# Altium schematic sheet 3.3V.SchDoc: 3.3V
size A; DrawnBy: Elijah; SheetNumber: 1; SheetTotal: 7
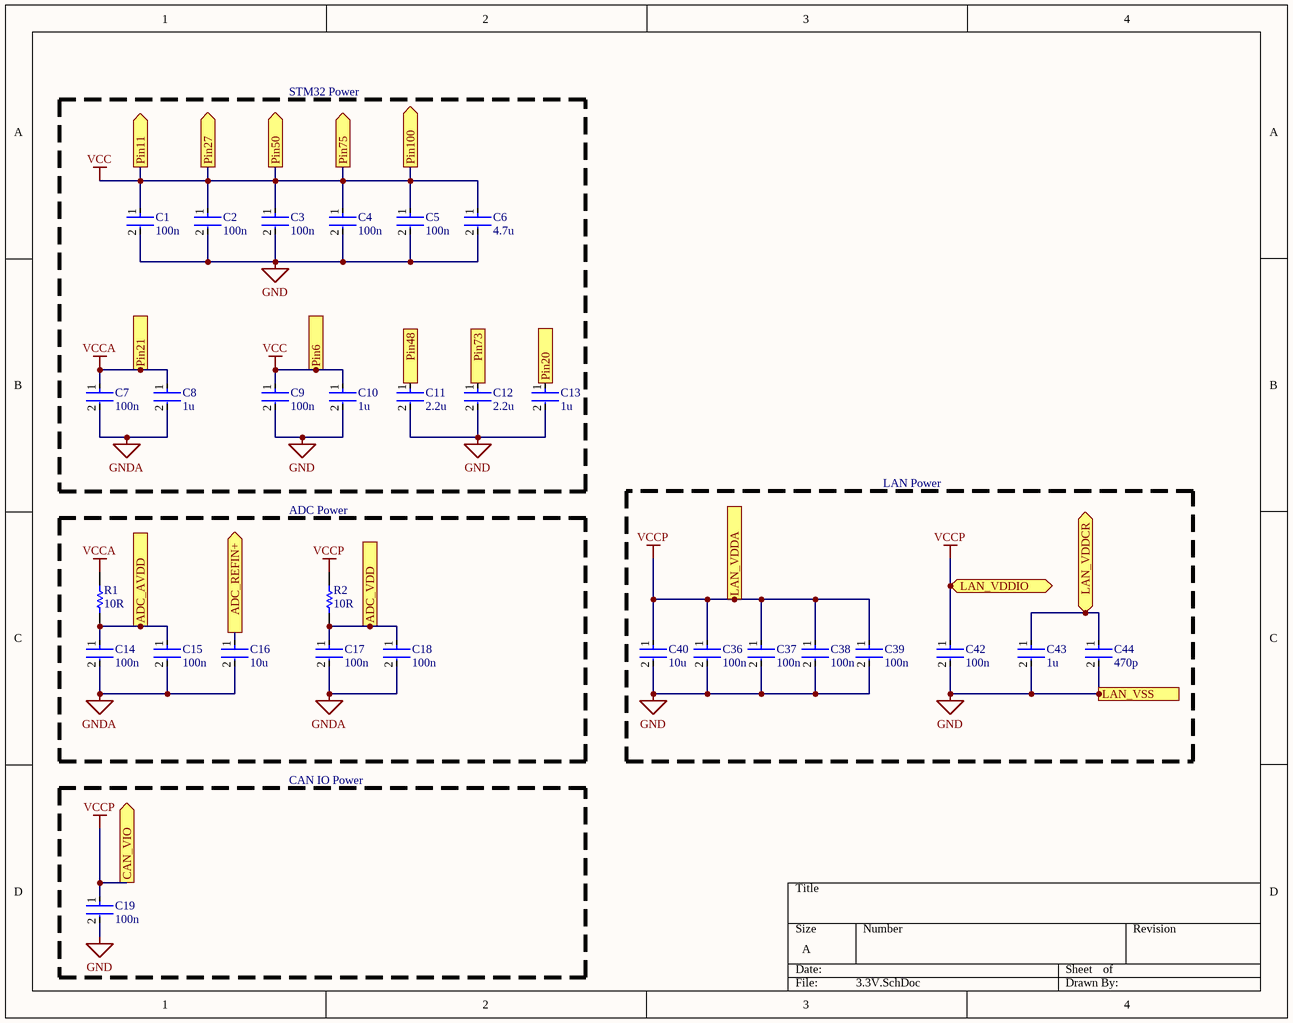
[diagram p0: 3.3V.SchDoc]

## Parts
C1  100n  [FP-GRM033-0_03-MFG]
C2  100n  [FP-GRM033-0_03-MFG]
C3  100n  [FP-GRM033-0_03-MFG]
C4  100n  [FP-GRM033-0_03-MFG]
C5  100n  [FP-GRM033-0_03-MFG]
C6  4.7u  [FP-C1005-050-0_15-MFG]
C7  100n  [FP-GRM033-0_03-MFG]
C8  1u  [FP-C2012-125-0_2-IPC_A]
C9  100n  [FP-GRM033-0_03-MFG]
C10  1u  [FP-C2012-125-0_2-IPC_A]
C11  2.2u  [FP-GRM188-0_1-e0_2_0_5-MFG]
C12  2.2u  [FP-GRM188-0_1-e0_2_0_5-MFG]
C13  1u  [FP-C2012-125-0_2-IPC_A]
C14  100n  [FP-GRM033-0_03-MFG]
C15  100n  [FP-GRM033-0_03-MFG]
C16  10u  [FP-C0805C-DG-MFG]
C17  100n  [FP-GRM033-0_03-MFG]
C18  100n  [FP-GRM033-0_03-MFG]
C19  100n  [FP-GRM033-0_03-MFG]
C36  100n  [FP-GRM033-0_03-MFG]
C37  100n  [FP-GRM033-0_03-MFG]
C38  100n  [FP-GRM033-0_03-MFG]
C39  100n  [FP-GRM033-0_03-MFG]
C40  10u  [FP-C0805C-DG-MFG]
C42  100n  [FP-GRM033-0_03-MFG]
C43  1u  [FP-C1005-050-0_15-MFG]
C44  470p  [FP-C1005-050-0_15-MFG]
R1  10R  [RESC2013X60X35ML10T20]
R2  10R  [RESC2013X60X35ML10T20]

## Blocks framed on the sheet
STM32 Power: C1-C13
LAN Power: C36-C40 C42-C44
ADC Power: C14-C18 R1 R2
CAN IO Power: C19

## Ports
ADC_AVDD (out, see ADC[1A]), ADC_REFIN+ (out, see ADC[2B]), ADC_VDD (out, see ADC[2A]), CAN_VIO (out, see ADC[3B]), LAN_VDDA (out, see ETH[2A]), LAN_VDDCR (bidir, see ETH[2B]), LAN_VDDIO (bidir, see ETH[2B]), LAN_VSS (see ETH[3C]), Pin6 (out, see MCUPinout[1A]), Pin11 (out, see MCUPinout[1B]), Pin20 (out, see MCUPinout[3B]), Pin21 (out, see MCUPinout[1B]), Pin27 (out, see MCUPinout[1B]), Pin48 (out, see MCUPinout[3C]), Pin50 (out, see MCUPinout[3A]), Pin73 (out, see MCUPinout[4B]), Pin75 (out, see MCUPinout[3B]), Pin100 (out, see MCUPinout[4A], MCUPinout[5B], MCUPinout[6B])

## Nets
GND: C1.2 C2.2 C3.2 C4.2 C5.2 C6.2 C9.2 C10.2 C11.2 C12.2 C13.2 C19.2 C36.2 C37.2 C38.2 C39.2 C40.2 C42.2 C43.2 C44.2 ; port LAN_VSS
GNDA: C7.2 C8.2 C14.2 C15.2 C16.2 C17.2 C18.2
VCC: C1.1 C2.1 C3.1 C4.1 C5.1 C6.1 C9.1 C10.1 ; port Pin11, port Pin27, port Pin50, port Pin75, port Pin100, port Pin6
VCCA: C7.1 C8.1 R1.1 ; port Pin21
VCCP: C19.1 C36.1 C37.1 C38.1 C39.1 C40.1 C42.1 R2.1 ; port CAN_VIO, port LAN_VDDA, port LAN_VDDIO
ADC_AVDD: C14.1 C15.1 R1.2 ; port ADC_AVDD
ADC_REFIN+: C16.1 ; port ADC_REFIN+
ADC_VDD: C17.1 C18.1 R2.2 ; port ADC_VDD
LAN_VDDCR: C43.1 C44.1 ; port LAN_VDDCR
Pin20: C13.1 ; port Pin20
Pin48: C11.1 ; port Pin48
Pin73: C12.1 ; port Pin73

## Library data of the parts
C1-C5 C7 C9 C14 C15 C17-C19 C36-C39 C42 = CMP-06035-000062-2: Chip Multilayer Ceramic Capacitors for General Purpose, 0201, 0.10uF, X5R, 15%, 10%, 6.3V; Capacitance: 100nF; Min Operating Temperature: -55°C; Lead Free: Lead Free; Radiation Hardening: No; Dielectric: X5R; Voltage Rating (DC): 6.3V; REACH SVHC: No SVHC; Case/Package: 0201; Voltage Rating: 6.3V; Length: 0.6mm; Max Operating Temperature: 85°C; Width: 0.012inch; Depth: 0.3mm; Material: Ceramic; Case Code (Metric): 0603; Thickness: 0.013inch; Packaging: Tape and Reel; Height: 0.3mm; Weight: 6E-06oz; Package Quantity: 1; Mount: Surface Mount; Voltage: 6.3V; Case Code (Imperial): 0201; Tolerance: 10%; Termination: SMD/SMT
C6 C43 C44 = CMP-2000-05997-2: CAP CER 4.7UF 10V X5R 0402; Dielectric Material: Ceramic; Tolerance: 10%; Series: C; Package Quantity: 10000; Max Operating Temperature: 85°C; Case Code (Imperial): 0402; Lead Free: Lead Free; Voltage Rating (DC): 10V; Packaging: Cut Tape; Voltage Rating: 10V; Min Operating Temperature: -55°C; Dielectric: X5R; Thickness: 0.022inch; Width: 0.02inch; Case/Package: 0402; Case Code (Metric): 1005; Capacitance: 4.7uF; Length: 0.039inch; RoHS Compliant: Yes; REACH SVHC: No SVHC; Mount: Surface Mount
C8 C10 C13 = CMP-08246-005389-1: Multilayer Ceramic Capacitors 1μF ±10% 25V X5R SMD 0805; Capacitance: 1uF; Min Operating Temperature: -55°C; Construction: Flat; Package Quantity: 2000; Height: 1.25mm; Resistor Type: Ceramic; Case/Package: 0805; Depth: 1.25mm; Case Code (Metric): 2012; Weight: 0.000194oz; REACH SVHC: No SVHC; Dielectric: X5R; Max Operating Temperature: 85°C; Number of Pins: 2; Thickness: 0.057inch; RoHS Compliant: Yes; Radiation Hardening: No; Lead Free: Lead Free; Case Code (Imperial): 0805; Length: 2mm; Voltage Rating: 25V; Mount: Surface Mount; Voltage Rating (DC): 25V; Packaging: Tape and Reel; Dielectric Material: Ceramic; Termination: SMD/SMT; Voltage: 25V; Tolerance: 10%; Series: C; Width: 0.049inch
C11 C12 = CMP-2006-02836-2: Chip Multilayer Ceramic Capacitors for General Purpose, 0603, 2.2uF, X7R, 15%, 10%, 10V; Case Code (Metric): 1608; Height: 0.8mm; Packaging: Cut Tape; Voltage: 10V; Lead Free: Lead Free; Min Operating Temperature: -55°C; Voltage Rating (DC): 10V; Max Operating Temperature: 125°C; Voltage Rating: 10V; Dielectric: X7R; Depth: 0.8mm; Case Code (Imperial): 0603; Termination: SMD/SMT; Case/Package: 0603; Number of Pins: 2; REACH SVHC: No SVHC; Mount: Surface Mount; Width: 0.031inch; Material: Ceramic; Capacitance: 2.2uF; Package Quantity: 1; Weight: 7.1E-05oz; Length: 1.6mm; Thickness: 0.035inch; Tolerance: 10%
C16 C40 = CMP-2007-03243-2: CAP CER 10UF 10V X5R 0805; Manufacturer Part Number: C0805C106K8PACTU; Manufacturer: Kemet; 3DS Part Number: 220-00001; Tolerance: 10%; Temperature Coefficient: 15%; Material: Ceramic; Device Class L2: Capacitors; Device Class L1: Passive Components; ComponentLink2URL: https://content.kemet.com/datasheets/KEM_C1006_X5R_SMD.pdf; Height: 1.4mm; Lead Free: Yes; Digikey Description: CAP CER 10UF 10V X5R 0805; Octopart: https://octopart.com/c0805c106k8pactu-kemet-98697; Capacitance: 10uF; Value: 10uF; Temperature Range Low: -55°C; Temperature: -55°C to +85°C; Automotive: No; Mouser Description: CAP CER 10UF 10V X5R 0805; Ipc Land Pattern Name: CAPC200125X125; Temperature Range High: +85°C; Voltage: 10V; RoHS: TRUE; Device Class L3: Ceramic Capacitors; ComponentLink2Description: Datasheet; Voltage Rating: 10V; Package: C0805C-DG; Temperature Characteristic: X5R; Category: Cap
R1 R2 = CMP-2100-03670-1: Chip Resistor, 10 Ohm, +/- 1%, 0.125 W, -55 to 155 degC, 0805 (2012 Metric), RoHS, Tape and Reel; Manufacturer: Yageo; Resistance: 10Ohm; Power Rating: 125mW; Voltage Rating: 150V; Temperature Coefficient: 200ppm/degreesC; Number of Pins: 2; REACH SVHC: NoSVHC; Datasheet Version: Rev. 5, 10/2016; Max Operating Temperature: 155degC; Manufacturer URL: http://www.yageo.com/; Case Code (Imperial): 0805; Package Description: 2-Pin Surface Mounted Device, Body 2 x 1.25 mm; Case Code (Metric): 2012; Length: 2mm; RoHSCompliant: true; Max Power Dissipation: 125mW; Depth: 1.25mm; Packaging: TapeandReel; Height: 0.5mm; Package Reference: 0805; Package Quantity: 1; Tolerance: 1%; Termination: SMD/SMT; Min Operating Temperature: -55degC; Lead Free: LeadFree; Width: 1.25mm; Voltage Rating (DC): 150V; Datasheet URL: http://www.yageo.com/NewPortal/yageodocoutput?fileName=/pdf/R-Chip/PYu-RC_Group_51_RoHS_L_5.pdf; Composition: ThickFilm; Number of Terminations: 2; Case/Package: 0805